# EAGLE schematic Sidewinder_Joystick_Buttonpad (EAGLE 7.3.0)
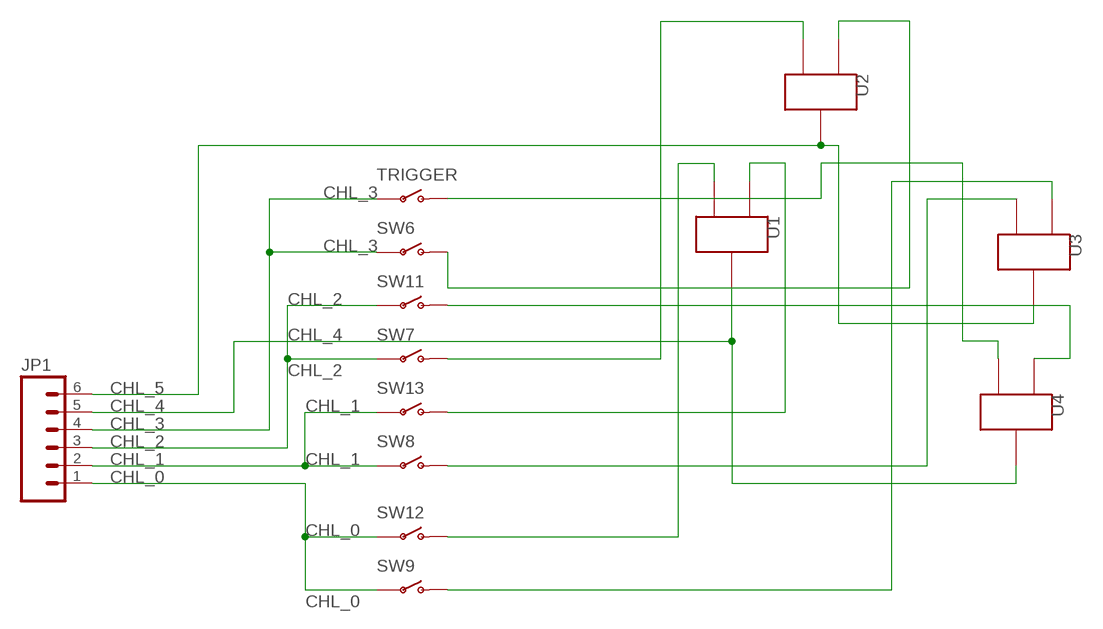
[diagram p0: schematic, sheet 1]

## Parts
JP1  M06NO_SILK_FEMALE_PTH  [1X06_NO_SILK]
SW6  SWITCH-SPST-2TV  [SWITCH-SPST-VERTICAL]
SW7  SWITCH-SPST-2TV  [SWITCH-SPST-VERTICAL]
SW8  SWITCH-SPST-2TV  [SWITCH-SPST-VERTICAL]
SW9  SWITCH-SPST-2TV  [SWITCH-SPST-VERTICAL]
SW11  SWITCH-SPST-2TV  [SWITCH-SPST-VERTICAL]
SW12  SWITCH-SPST-2TV  [SWITCH-SPST-VERTICAL]
SW13  SWITCH-SPST-2TV  [SWITCH-SPST-VERTICAL]
TRIGGER  SWITCH-SPST-2TV  [SWITCH-SPST-VERTICAL]
U1  MYSTERY-3-S0T23SOT23-3  [SOT23-3]
U2  MYSTERY-3-S0T23SOT23-3  [SOT23-3]
U3  MYSTERY-3-S0T23SOT23-3  [SOT23-3]
U4  MYSTERY-3-S0T23SOT23-3  [SOT23-3]

## Nets
CHL_0: JP1.1 SW9.2(P) SW12.2(P)
CHL_1: JP1.2 SW8.2(P) SW13.2(P)
CHL_2: JP1.3 SW7.2(P) SW11.2(P)
CHL_3: JP1.4 SW6.2(P) TRIGGER.2(P)
CHL_4: JP1.5 U1.2 U4.2
CHL_5: JP1.6 U2.2 U3.2
SW6: SW6.1(O) U2.1
SW7: SW7.1(O) U2.3
SW8: SW8.1(O) U3.3
SW9: SW9.1(O) U3.1
SW11: SW11.1(O) U4.1
SW12: SW12.1(O) U1.3
SW13: SW13.1(O) U1.1
TRIG: TRIGGER.1(O) U4.3

## Library data of the parts
JP1 = SparkFun-Connectors:M06: Header 6 Standard 6-pin 0.1" header. Use with straight break away headers (SKU : PRT-00116), right angle break away headers (PRT-00553), swiss pins (PRT-00743), machine pins (PRT-00117), and female headers (PRT-00115). Molex polarized connector foot print use with SKU : PRT-08094 with associated crimp pins and housings. NOTES ON THE VARIANTS LOCK and LOCK_LONGPADS... This footprint was designed to help hold the alignment of a through-hole component (i.e. 6-pin header) while soldering it into place. You may notice that each hole has been shifted either up or down by 0.005 of an inch from it's more standard position (which is a perfectly straight line). This slight alteration caused the pins (the squares in the middle) to touch the edges of the holes. Because they are alternating, it causes a "brace" to hold the component in place. 0.005 has proven to be the perfect amount of "off-center" position when using our standard breakaway headers. Although looks a little odd when you look at the bare footprint, once you have a header in there, the alteration is very hard to notice. Also,if you push a header all the way into place, it is covered up entirely on the bottom side. This idea of altering the position of holes to aid alignment will be further integrated into the Sparkfun Library for other footprints. It can help hold any component with 3 or more connection pins.; PROD_ID: CONN-08437
SW6-SW9 SW11-SW13 TRIGGER = SparkFun-Electromechanical:SWITCH-SPST-2
U1-U4 = hacking_library:MYSTERY-3-S0T23